# EAGLE schematic dial-a-hue (EAGLE 9.3.0)
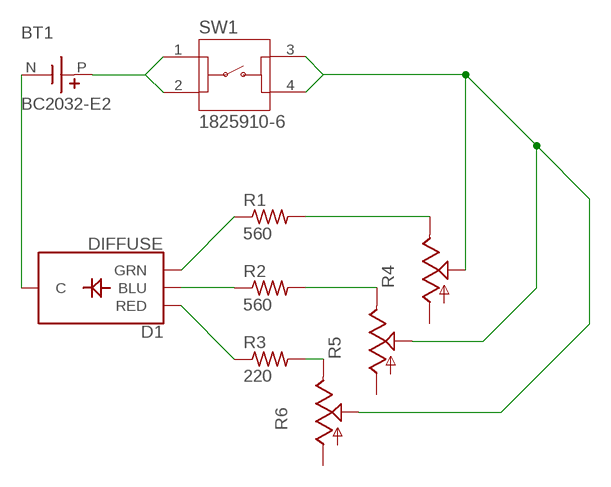
[diagram p0: schematic, sheet 1]

## Parts
BT1  BC2032-E2  [MPD_BC2032-E2]
D1  DIFFUSE  LED-RGB-CCDIFFUSE  [LED-RGB-THRU]
R1  560  R-US_0207/10  [0207/10]
R2  560  R-US_0207/10  [0207/10]
R3  220  R-US_0207/10  [0207/10]
R4  TRIM_US-LI10  [LI10]
R5  TRIM_US-LI10  [LI10]
R6  TRIM_US-LI10  [LI10]
SW1  1825910-6  [SW_1825910-6-4]

## Nets
N$1: D1.1(RED) R3.1
N$2: D1.4(BLU) R2.1
N$3: D1.3(GRN) R1.1
N$4: R1.2 R4.E
N$5: R2.2 R5.E
N$6: R3.2 R6.E
N$7: BT1.N D1.2(C)
N$8: BT1.P SW1.1 SW1.2
N$9: R4.S R5.S R6.S SW1.3 SW1.4
Unconnected: R4.A R5.A R6.A

## Library data of the parts
BT1 = BC2032-E2:BC2032-E2: Holder Battery Cr2032 Sony Equal; DESCRIPTION: Holder Battery Cr2032 Sony Equal; DIGI-KEY_PART_NUMBER: BC2032-E2-ND; DIGI-KEY_PURCHASE_URL: https://www.digikey.com/product-detail/en/mpd-memory-protection-devices/BC2032-E2/BC2032-E2-ND/2077836?utm_source=snapeda&utm_medium=aggregator&utm_campaign=symbol; MF: MPD _Memory; MP: BC2032-E2; PACKAGE: DFN-8 Memory Protection Devices
D1 = gc rgb-LED:LED-RGB-CC: LED-RGB Common Cathode Packages: LED RGB-THRU LED_PIRANHA_5MM SparkFun Products: RGB Diffused Common Cathode- Diffuse <[https://www.sparkfun.com/products/9264]> RGB Diffused Common Cathode - Clear <[https://www.sparkfun.com/products/105]> LED-RGB 5mm Square (Piranha) <[https://www.sparkfun.com/products/11679]>; PROD_ID: DIO-09434
R1-R3 = adafruit:R-US_: RESISTOR, American symbol
R4-R6 = pot:TRIM_US-: POTENTIOMETER
SW1 = 1825910-6:1825910-6: Switch Tactile OFF (ON) SPST Round Button PC Pins 0.05A 24VDC 100000Cycles 1.57N Thru-Hole Loose; COMMENT: 1825910-6; CONFIGURATION_POLE-THROW: Single Pole - Single Throw; CONTACT_CURRENT_RATING: 50 mA; DESCRIPTION: FSM4JH=6MM TACT SWITCH, HIGH TEMP; DIGI-KEY_PART_NUMBER: 450-1650-ND; DIGI-KEY_PURCHASE_URL: https://www.digikey.com/product-detail/en/te-connectivity-alcoswitch-switches/1825910-6/450-1650-ND/1632536?utm_source=snapeda&utm_medium=aggregator&utm_campaign=symbol; EU_ROHS_COMPLIANCE: Compliant; MF: TE Connectivity; MP: 1825910-6; PACKAGE: None; TE_PURCHASE_URL: https://www.te.com/usa-en/product-1825910-6.html?te_bu=Cor&te_type=disp&te_campaign=seda_glo_cor-seda-global-disp-prtnr-fy19-seda-model-bom-cta_sma-317_1&elqCampaignId=32493

## Net classes
0 default: width 1 mm, drill 0.5 mm, clearance 0.2 mm